# Altium schematic sheet Pallette_Rev1.SchDoc: Pallette - Tongue Controlled Interface
size A3; DrawnBy: Joanna Zhang; Organization: Cornell Tech; Address1: 111 8th Ave #302; Address2: New York; Address3: NY 10011; Revision: 1; SheetNumber: 1; SheetTotal: 1; ProjectName: Pallette
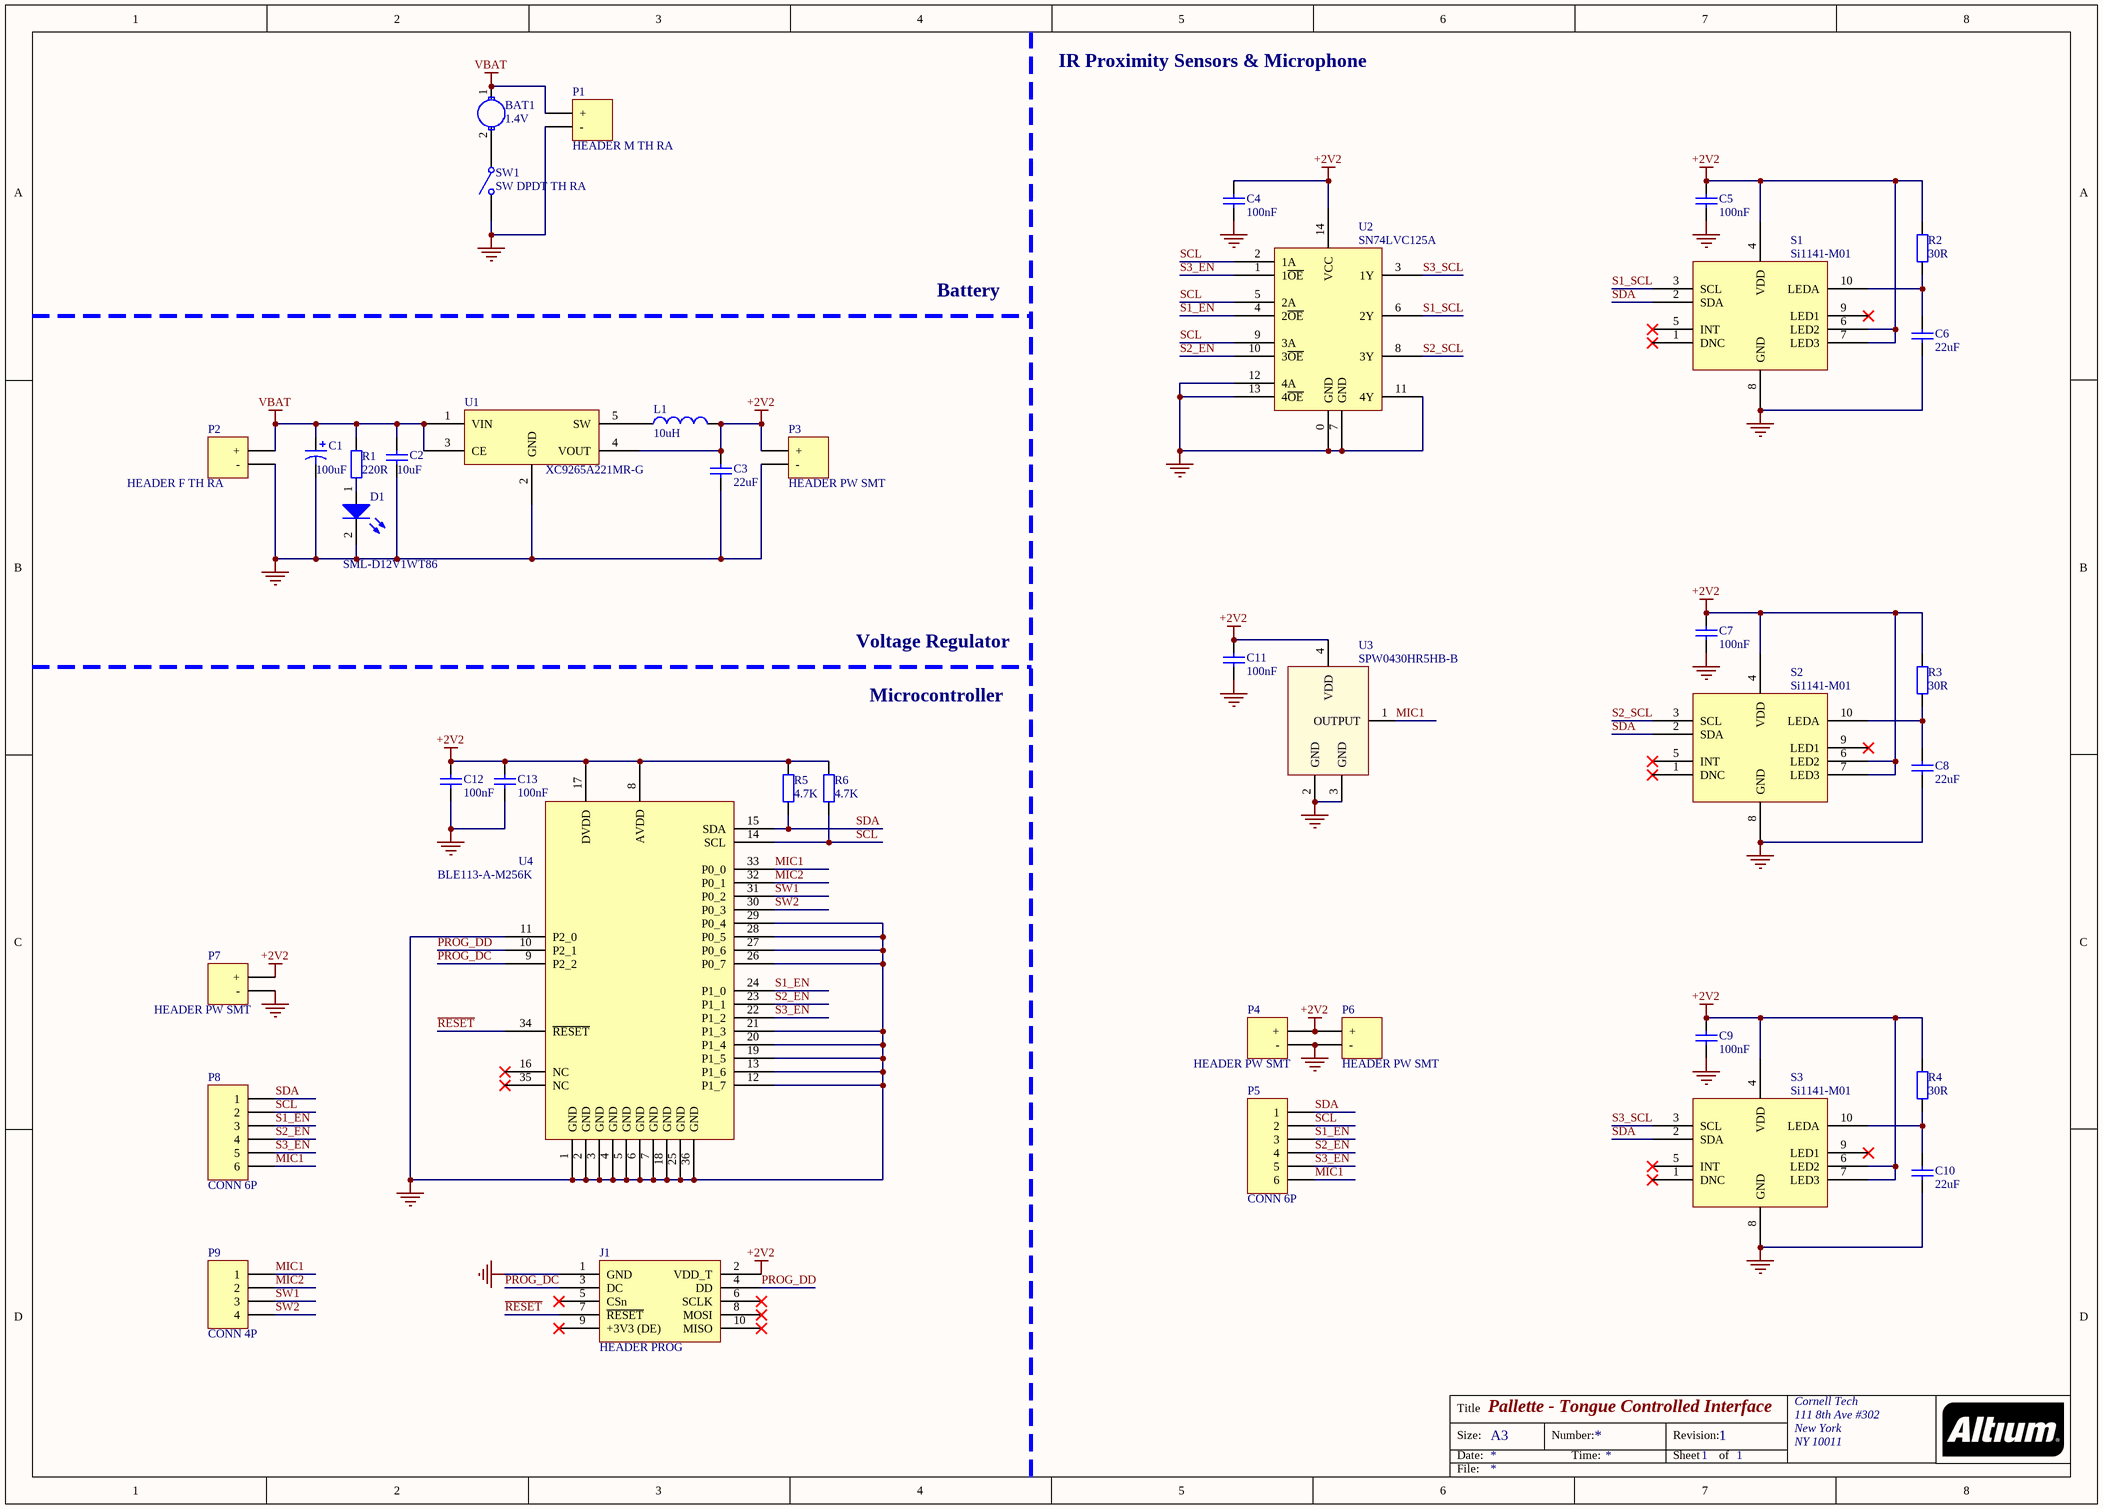
[diagram p0: Pallette_Rev1.SchDoc]

## Parts
BAT1  value 1.4V  [BAT RETAINER 13]  (hidden comment: RETAINER COIN CELL 7.9MM)
C1  100uF  [1411]
C2  10uF  [0603]
C3  22uF  [0603]
C4  100nF  [0402]
C5  100nF  [0402]
C6  22uF  [0603]
C7  100nF  [0402]
C8  22uF  [0603]
C9  100nF  [0402]
C10  22uF  [0603]
C11  100nF  [0402]
C12  100nF  [0402]
C13  100nF  [0402]
D1  SML-D12V1WT86  [LED 0603]
J1  HEADER PROG  [TC2050-IDC-NL]  (no BOM)
L1  10uH  [0805]
P1  HEADER M TH RA  [PORT PW TH 2P]  (no BOM)
P2  HEADER F TH RA  [PORT PW TH 2P]  (no BOM)
P3  HEADER PW SMT  [PORT PW SMT 2P]  (no BOM)
P4  HEADER PW SMT  [PORT PW SMT 2P]  (no BOM)
P5  CONN 6P  [PORT CONN 6P]  (no BOM)
P6  HEADER PW SMT  [PORT PW SMT 2P]  (no BOM)
P7  HEADER PW SMT  [PORT PW SMT 2P]  (no BOM)
P8  CONN 6P  [PORT CONN 6P]  (no BOM)
P9  CONN 4P  [PORT CONN 4P]  (no BOM)
R1  220R  [0603]
R2  30R  [0402]
R3  30R  [0402]
R4  30R  [0402]
R5  4.7K  [0402]
R6  4.7K  [0402]
S1  Si1141-M01  [SI1141-M01]
S2  Si1141-M01  [SI1141-M01]
S3  Si1141-M01  [SI1141-M01]
SW1  SW DPDT TH RA  [SW DPDT TH RA]
U1  XC9265A221MR-G  [SOT-25]
U2  SN74LVC125A  [VQFN14]
U3  SPW0430HR5HB-B  [MIC-4P]
U4  BLE113-A-M256K  [BLE113-A]

## Nets
+2V2: C3.2 C4.2 C5.2 C7.2 C9.2 C11.1 C12.2 C13.2 J1.2(VDD_T) L1.2 P3.1(+) P4.1(+) P6.1(+) P7.1(+) R2.2 R3.2 R4.2 R5.2 R6.2 S1.4(VDD) S1.6(LED2) S1.7(LED3) S2.4(VDD) S2.6(LED2) S2.7(LED3) S3.4(VDD) S3.6(LED2) S3.7(LED3) U1.4(VOUT) U2.14(VCC) U3.4(VDD) U4.8(AVDD) U4.17(DVDD)
GND: C1.2 C2.1 C3.1 C4.1 C5.1 C6.1 C7.1 C8.1 C9.1 C10.1 C11.2 C12.1 C13.1 D1.2(K) J1.1(GND) P1.2(-) P2.2(-) P3.2(-) P4.2(-) P6.2(-) P7.2(-) S1.8(GND) S2.8(GND) S3.8(GND) SW1.2(NO) U1.2(GND) U2.0(GND) U2.7(GND) U2.11(4Y) U2.12(4A) U2.13(4~{OE}) U3.2(GND) U3.3(GND) U4.1(GND) U4.2(GND) U4.3(GND) U4.4(GND) U4.5(GND) U4.6(GND) U4.7(GND) U4.11(P2_0) U4.12(P1_7) U4.13(P1_6) U4.18(GND) U4.19(P1_5) U4.20(P1_4) U4.21(P1_3) U4.25(GND) U4.26(P0_7) U4.27(P0_6) U4.28(P0_5) U4.29(P0_4) U4.36(GND)
VBAT: BAT1.1(+) C1.1 C2.2 P1.1(+) P2.1(+) R1.2 U1.1(VIN) U1.3(CE)
MIC1: P5.6 P8.6 P9.1 U3.1(OUTPUT) U4.33(P0_0)
MIC2: P9.2 U4.32(P0_1)
PROG_DC: J1.3(DC) U4.9(P2_2)
PROG_DD: J1.4(DD) U4.10(P2_1)
~{RESET}: J1.7(~{RESET}) U4.34(~{RESET})
S1_EN: P5.3 P8.3 U2.4(2~{OE}) U4.24(P1_0)
S1_SCL: S1.3(SCL) U2.6(2Y)
S2_EN: P5.4 P8.4 U2.10(3~{OE}) U4.23(P1_1)
S2_SCL: S2.3(SCL) U2.8(3Y)
S3_EN: P5.5 P8.5 U2.1(1~{OE}) U4.22(P1_2)
S3_SCL: S3.3(SCL) U2.3(1Y)
SCL: P5.2 P8.2 R6.1 U2.2(1A) U2.5(2A) U2.9(3A) U4.14(SCL)
SDA: P5.1 P8.1 R5.1 S1.2(SDA) S2.2(SDA) S3.2(SDA) U4.15(SDA)
SW1: P9.3 U4.31(P0_2)
SW2: P9.4 U4.30(P0_3)
NetBAT1_2: BAT1.2(-) SW1.1(COMMON)
NetC6_2: C6.2 R2.1 S1.10(LEDA)
NetC8_2: C8.2 R3.1 S2.10(LEDA)
NetC10_2: C10.2 R4.1 S3.10(LEDA)
NetD1_1: D1.1(A) R1.1
NetL1_1: L1.1 U1.5(SW)

Not connected (* = marked no-connect by the designer): J1 5(CSn)* 6(SCLK)* 8(MOSI)* 9(+3V3_(DE))* 10(MISO)*; S1 1(DNC)* 5(INT)* 9(LED1)*; S2 1(DNC)* 5(INT)* 9(LED1)*; S3 1(DNC)* 5(INT)* 9(LED1)*; U4 16(NC)* 35(NC)*

## Notes on the sheet
- IR Proximity Sensors & Microphone
- Battery
- Voltage Regulator
- Microcontroller
- Title
- Size:
- Date:
- A3
- Number:
- Time:
- Revision:
- Sheet
- of
- File:

## Library data of the parts
BAT1 = BAT RETAINER 13: RETAINER COIN CELL 7.9MM SMD; Manufacturer: Keystone Electronics; Manufacturer Part Number: 2988; Digi-Key Part Number: 36-2988-ND
C1 = CAP Pol 100uF: CAP TANT POLY 100UF 8V 1411; Manufacturer: Panasonic Electronic Components; Manufacturer Part Number: 8TPE100MAZB; Digi-Key Part Number: P16641CT-ND; Value: 100uF
C2 = CAP 10uF: CAP CER 10UF ±20% 10V X5R 0603; Manufacturer Part Number: GRM188R61A106MAALD; Manufacturer: Murata; Digi-Key Part Number: 490-12734-1-ND; Value: 10uF
C3 C6 = CAP 22uF: CAP CER 22UF 6.3V X5R 0603; Manufacturer Part Number: GRM188R60J226MEA0D; Manufacturer: Murata; Digi-Key Part Number: 490-7611-1-ND; Value: 22uF
C4 C5 C7 C9 C11-C13 = Cap 100nF: CAP CER 0.1UF 10V X5R 0402; Manufacturer: Murata; Manufacturer Part Number: GRM155R61A104KA01D; Digi-Key Part Number: 490-1318-1-ND; Value: 100nF
C8 C10 = Cap 22uF: CAP CER 22UF 6.3V X5R 0603; Manufacturer Part Number: GRM188R60J226MEA0D; Manufacturer: Murata; Digi-Key Part Number: 490-7611-1-ND; Value: 22uF
D1 = LED SML-D12V1WT86: LED Red 630nm 2.2V Diffused White Lens 0603; Manufacturer: Rohm Semiconductor; Manufacturer Part Number: SML-D12V1WT86; Digi-Key Part Number: SML-D12V1WT86CT-ND
J1 = HEADER PROG: PADS PROGRAMMING
L1 = IND 10uH: FIXED IND 10UH 500MA 320 MOHM; Manufacturer: Abracon LLC; Manufacturer Part Number: AIML-0805HC-100M-T; Digi-Key Part Number: 535-12791-1-ND; Value: 10uH
P1 = HEADER PW TH MALE: HEADER Male, Unshrouded, 2 Position, 0.100", Through Hole, Right Angle, Gold; Manufacturer: 3M; Manufacturer Part Number: 961102-5604-AR; Digi-Key Part Number: 3M9467-ND
P2 = HEADER PW TH FEMALE: HEADER Female, 2 Position, 0.100", Through Hole, Right Angle, Gold; Manufacturer Part Number: PPPC021LGBN-RC; Manufacturer: Sullins Connector Solutions; Digi-Key Part Number: S5477-ND
P3 P4 P6 P7 = HEADER PW SMT: Connection Port; LatestRevisionDate: 17-Jul-2002; LatestRevisionNote: Re-released for DXP Platform.; Publisher: Altium Limited
P5 P8 = HEADER CONN 6P: Connection Port; LatestRevisionDate: 17-Jul-2002; LatestRevisionNote: Re-released for DXP Platform.; Publisher: Altium Limited
P9 = HEADER CONN 4P: Connection Port; LatestRevisionDate: 17-Jul-2002; LatestRevisionNote: Re-released for DXP Platform.; Publisher: Altium Limited
R1 = RES 220R: RES SMD 220 OHM 1% 1/10W 0603; Manufacturer: Panasonic; Manufacturer Part Number: ERJ-3EKF2200V; Digi-Key Part Number: P220HCT-ND
R2-R4 = Res 30R: RES SMD 30 OHM 1% 1/16W 0402; Manufacturer: Yageo; Manufacturer Part Number: RC0402FR-0730RL; Digi-Key Part Number: 311-30LRCT-ND
R5 R6 = Res 4.7K: RES SMD 4.7K OHM 1% 1/16W 0402; Manufacturer: Yageo; Manufacturer Part Number: RC0402FR-074K7L; Digi-Key Part Number: 311-4.7KLRCT-ND
S1-S3 = SENS Si1141-M01: SENS IR PROXIMITY AMB LT 10QFN; Manufacturer: Silicon Labs; Manufacturer Part Number: SI1141-M01-GMR; Digi-Key Part Number: 336-3260-1-ND
SW1 = SW DPDT: SW Slide Switch DPDT Through Hole, Right Angle; Manufacturer: C&K Components; Manufacturer Part Number: JS202011AQN; Digi-Key Part Number: 401-2000-ND
U1 = VR XC9265A221MR-G: IC REG BUCK 2.2V 0.2A SYNC SOT25; Manufacturer: Torex Semiconductor Ltd; Digi-Key Part Number: 893-1305-1-ND; Manufacturer Part Number: XC9265A221MR-G
U2 = BUFF SN74LVC125A: IC BUS BUFF TRI-ST QD 14VQFN; Manufacturer: Texas Instruments; Manufacturer Part Number: SN74LVC125ARGYR; Digi-Key Part Number: 296-13961-1-ND
U3 = MIC SPW0430HR5HB-B: MIC MEMS ANALOG OMNI; Manufacturer: Knowles; Digi-Key Part Number: 423-1215-1-ND; Manufacturer Part Number: SPW0430HR5HB-B
U4 = uC BLE113: MODULE BT 4.0 BLE113 OTA; Manufacturer: Silicon Labs; Manufacturer Part Number: BLE113-A-M256K; Digi-Key Part Number: 1446-1035-1-ND